# EAGLE design insect-bot (EAGLE 6.1)
Insect Bot schematic
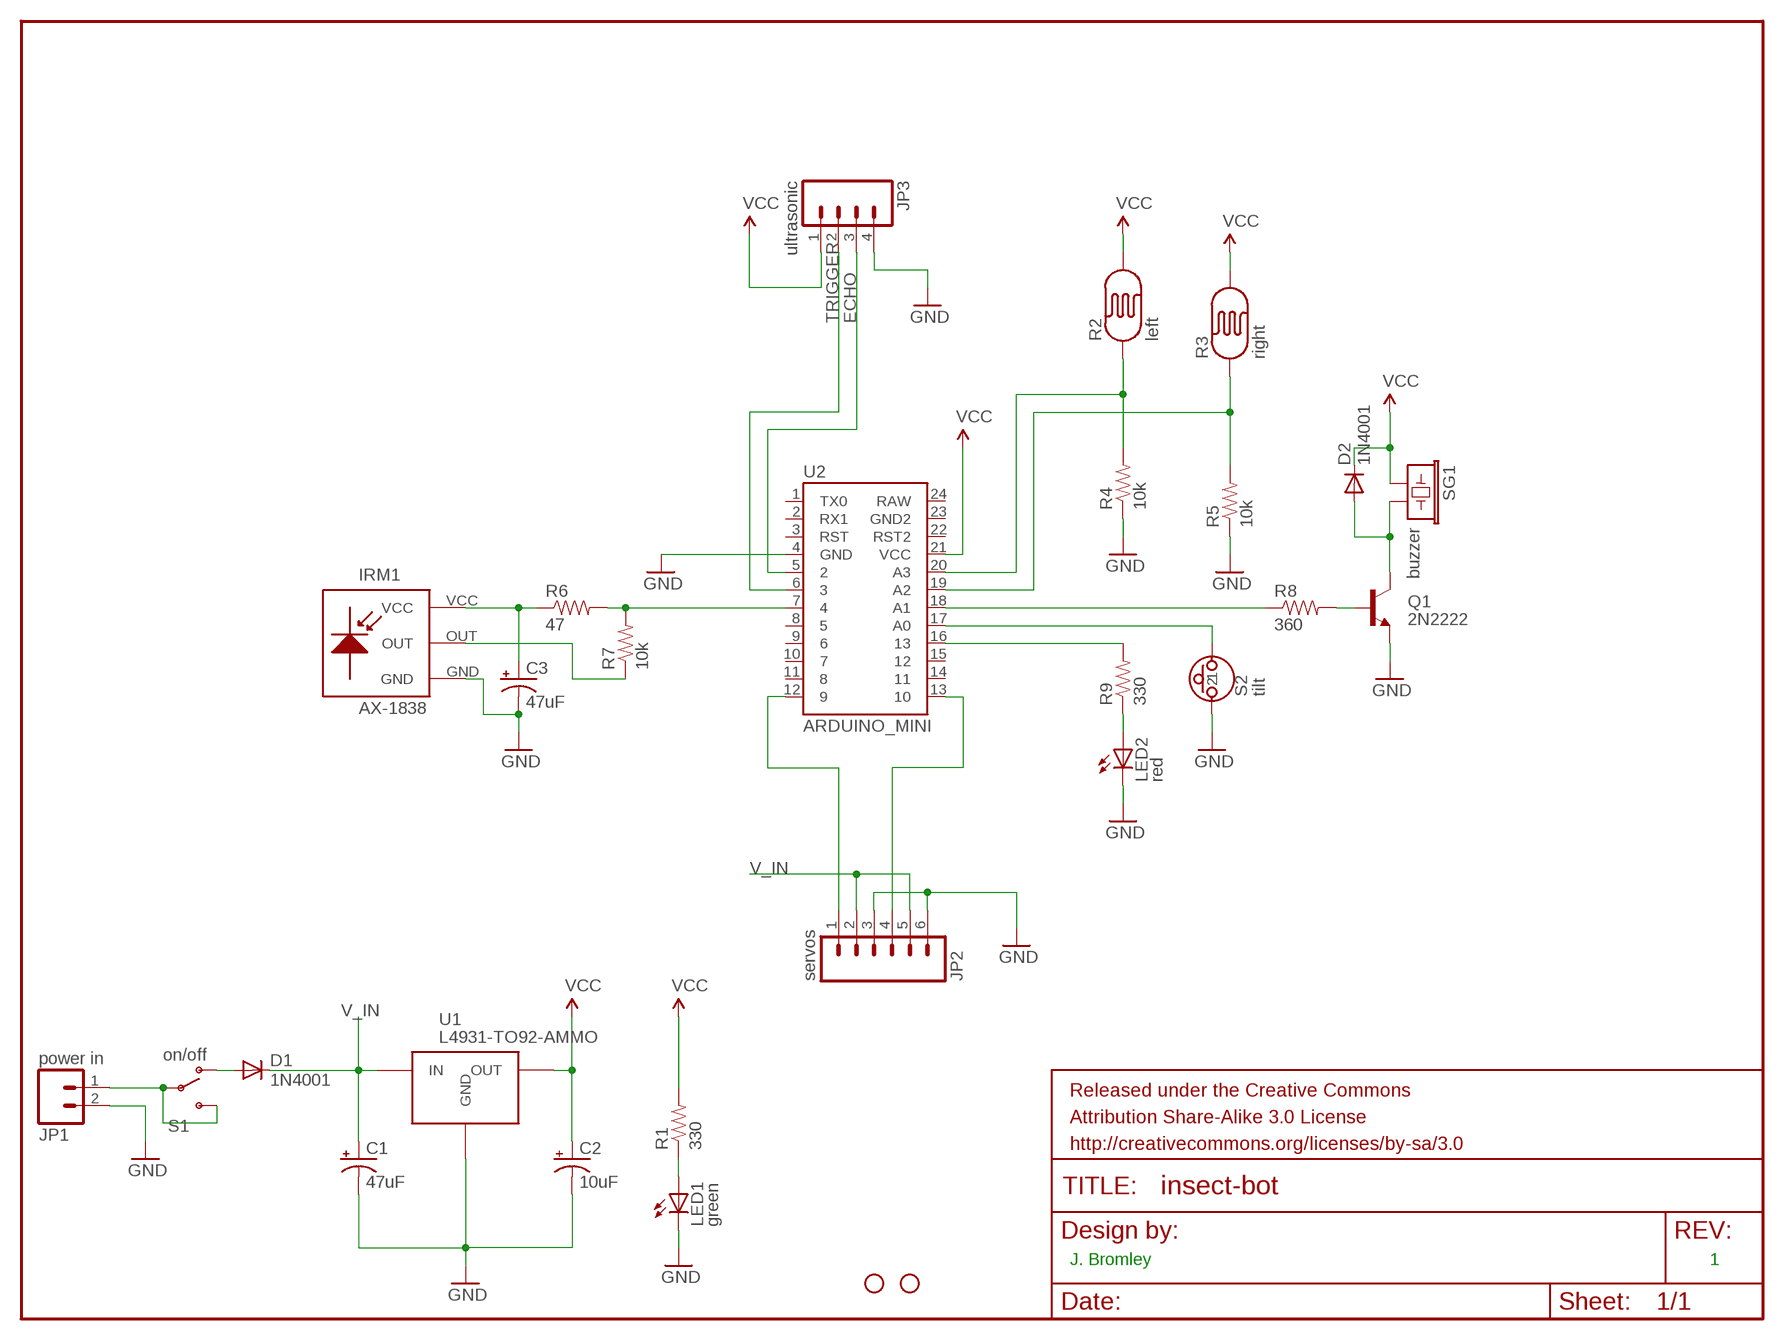
[diagram p0: schematic, sheet 1]

## Parts
C1  47uF  CAP_POLPTH2  [CPOL-RADIAL-10UF-25V]
C2  10uF  CAP_POLPTH2  [CPOL-RADIAL-10UF-25V]
C3  47uF  CAP_POLPTH1  [CPOL-RADIAL-100UF-25V]
D1  1N4001  DIODEPTH  [DIODE-1N4001]
D2  1N4001  DIODEPTH  [DIODE-1N4001]
IRM1  AX-1838  [AX-1838]
JP1  power in  M02PTH  [1X02]
JP2  servos  M06SIP  [1X06]
JP3  ultrasonic  M04PTH  [1X04]
JP4  STAND-OFF  [STAND-OFF]
JP5  STAND-OFF  [STAND-OFF]
LED1  green  LED3MM  [LED3MM]
LED2  red  LED3MM  [LED3MM]
Q1  2N2222  TRANSISTOR_NPNTO-92-AMMO  [TO-92-AMMO]
R1  330  RESISTORAXIAL-0.3  [AXIAL-0.3]
R2  left  PHOTOCELLPTH  [PHOTOCELL]
R3  right  PHOTOCELLPTH  [PHOTOCELL]
R4  10k  RESISTORAXIAL-0.3  [AXIAL-0.3]
R5  10k  RESISTORAXIAL-0.3  [AXIAL-0.3]
R6  47  RESISTORAXIAL-0.3  [AXIAL-0.3]
R7  10k  RESISTORAXIAL-0.3  [AXIAL-0.3]
R8  360  RESISTORAXIAL-0.3  [AXIAL-0.3]
R9  330  RESISTORAXIAL-0.3  [AXIAL-0.3]
S1  on/off  SWITCH-SPDTPTH  [SWITCH-SPDT]
S2  tilt  TILTSWITCH  [RADIAL-100]
SG1  buzzer  BUZZERPTH  [BUZZER-12MM]
U1  L4931-TO92-AMMO  [TO-92-AMMO]
U2  ARDUINO_MINI  [ARDUINO_MINI]

## Nets
ECHO: JP3.3 U2.5
GND [power]: C1.2(-) C2.2(-) C3.2(-) IRM1.GND JP1.2 JP2.3 JP2.6 JP3.4 LED1.K(C) LED2.K(C) Q1.1(E) R4.P$1 R5.P$1 S2.1 U1.2(GND) U2.4(GND)
N$1 [power]: JP1.1 S1.2(P) S1.3(S)
N$2 [power]: D1.A S1.1(O)
N$3: LED1.A R1.P$1
N$4: JP2.1 U2.12
N$5: JP2.4 U2.13
N$6: R8.P$1 U2.18(A1)
N$7: R3.1 R5.P$2 U2.19(A2)
N$8: R2.1 R4.P$2 U2.20(A3)
N$9: R6.P$2 R7.P$2 U2.7
N$10: Q1.2(B) R8.P$2
N$11: D2.A Q1.3(C) SG1.-
N$12: S2.2 U2.17(A0)
N$13: R9.P$2 U2.16
N$14: LED2.A R9.P$1
REMOTE: IRM1.OUT R7.P$1
TRIGGER: JP3.2 U2.6
V_IN [power]: C1.1(+) D1.C JP2.2 JP2.5 U1.1(IN)
VCC [power]: C2.1(+) C3.1(+) D2.C IRM1.VCC JP3.1 R1.P$2 R2.2 R3.2 R6.P$1 SG1.+ U1.3(OUT) U2.21(VCC)
Unconnected: U2.1(TX0) U2.2(RX1) U2.3(RST) U2.8 U2.9 U2.10 U2.11 U2.14 U2.15 U2.22(RST2) U2.23(GND2) U2.24(RAW)

## Notes on the sheet
- J. Bromley | 1

## Library data of the parts
C1-C3 = SparkFun-Passives:CAP_POL: Capacitor Polarized These are standard SMD and PTH capacitors. Normally 10uF, 47uF, and 100uF in electrolytic and tantalum varieties. Always verify the external diameter of the through hole cap, it varies with capacity, voltage, and manufacturer. The EIA devices should be standard.
D1 D2 = SparkFun-DiscreteSemi:DIODE: Diode These are standard reverse protection diodes and small signal diodes. SMA package can handle up to about 1A. SOD-323 can handle about 200mA. What the SOD-323 package when ordering, there are some mfgs out there that are 5-pin packages.
IRM1 = jb-eagle:AX-1838: AX-1838HS Infrared Receiver The AX-1838HS is a miniaturized infrared receiver for remote control and other applications requiring improved ambient light rejection.
JP1 = SparkFun-Connectors:M02: Header 2 Standard 2-pin 0.1" header. Use with straight break away headers (SKU : PRT-00116), right angle break away headers (PRT-00553), swiss pins (PRT-00743), machine pins (PRT-00117), and female headers (PRT-00115). Molex polarized connector foot print use with SKU : PRT-08233 with associated crimp pins and housings.
JP2 = SparkFun-Connectors:M06: Header 6 Standard 6-pin 0.1" header. Use with straight break away headers (SKU : PRT-00116), right angle break away headers (PRT-00553), swiss pins (PRT-00743), machine pins (PRT-00117), and female headers (PRT-00115). Molex polarized connector foot print use with SKU : PRT-08094 with associated crimp pins and housings. NOTES ON THE VARIANTS LOCK and LOCK_LONGPADS... This footprint was designed to help hold the alignment of a through-hole component (i.e. 6-pin header) while soldering it into place. You may notice that each hole has been shifted either up or down by 0.005 of an inch from it's more standard position (which is a perfectly straight line). This slight alteration caused the pins (the squares in the middle) to touch the edges of the holes. Because they are alternating, it causes a "brace" to hold the component in place. 0.005 has proven to be the perfect amount of "off-center" position when using our standard breakaway headers. Although looks a little odd when you look at the bare footprint, once you have a header in there, the alteration is very hard to notice. Also, if you push a header all the way into place, it is covered up entirely on the bottom side. This idea of altering the position of holes to aid alignment will be further integrated into the Sparkfun Library for other footprints. It can help hold any component with 3 or more connection pins.
JP3 = SparkFun-Connectors:M04: Header 4 Standard 4-pin 0.1" header. Use with straight break away headers (SKU : PRT-00116), right angle break away headers (PRT-00553), swiss pins (PRT-00743), machine pins (PRT-00117), and female headers (PRT-00115). Molex polarized connector foot print use with SKU : PRT-08231 with associated crimp pins and housings. 1MM SMD Version SKU: PRT-10208
JP4 JP5 = SparkFun-Electromechanical:STAND-OFF: #4 Stand Off This is the mechanical footprint for a #4 phillips button head screw. Use the keepout ring to avoid running the screw head into surrounding components. SKU : PRT-00447
LED1 LED2 = SparkFun-LED:LED: LEDs Standard schematic elements and footprints for 5mm, 3mm, 1206, and 0603 sized LEDs. 5mm - Spark Fun Electronics SKU : COM-00529 (and others)
Q1 = SparkFun-DiscreteSemi:TRANSISTOR_NPN: Generic NPN BJT. MMBT2222 is the common NPN we use. Double check against datasheet- not all devices are the same!
R1 R4-R9 = SparkFun-Passives:RESISTOR: Resistor Basic schematic elements and footprints for 0603, 1206, and PTH resistors.
R2 R3 = SparkFun-Sensors:PHOTOCELL: CdS photoresistor. This is a low cost way to detect light levels. Resistance decreases with more incoming light. SparkFun SKU: SEN-09088
S1 = SparkFun-Electromechanical:SWITCH-SPDT: SPST Switch Simple slide switch. Spark Fun Electronics SKU : COM-00102
S2 = jb-eagle:TILTSWITCH: Rolling ball sensor, normally open
SG1 = SparkFun-Electromechanical:BUZZER: Buzzer 12mm Spark Fun Electronics SKU : Comp-Buzzer
U1 = jb-eagle:L4931-TO92-AMMO: Very low dropout regulator.
U2 = SparkFun-Boards:ARDUINO_MINI: Arduino Pro Mini footprint

## Net classes
0 default: width 0.61 mm, drill 0.203 mm, clearance 0.406 mm
1 power: width 0.813 mm, drill 0.203 mm, clearance 0.406 mm

## Board
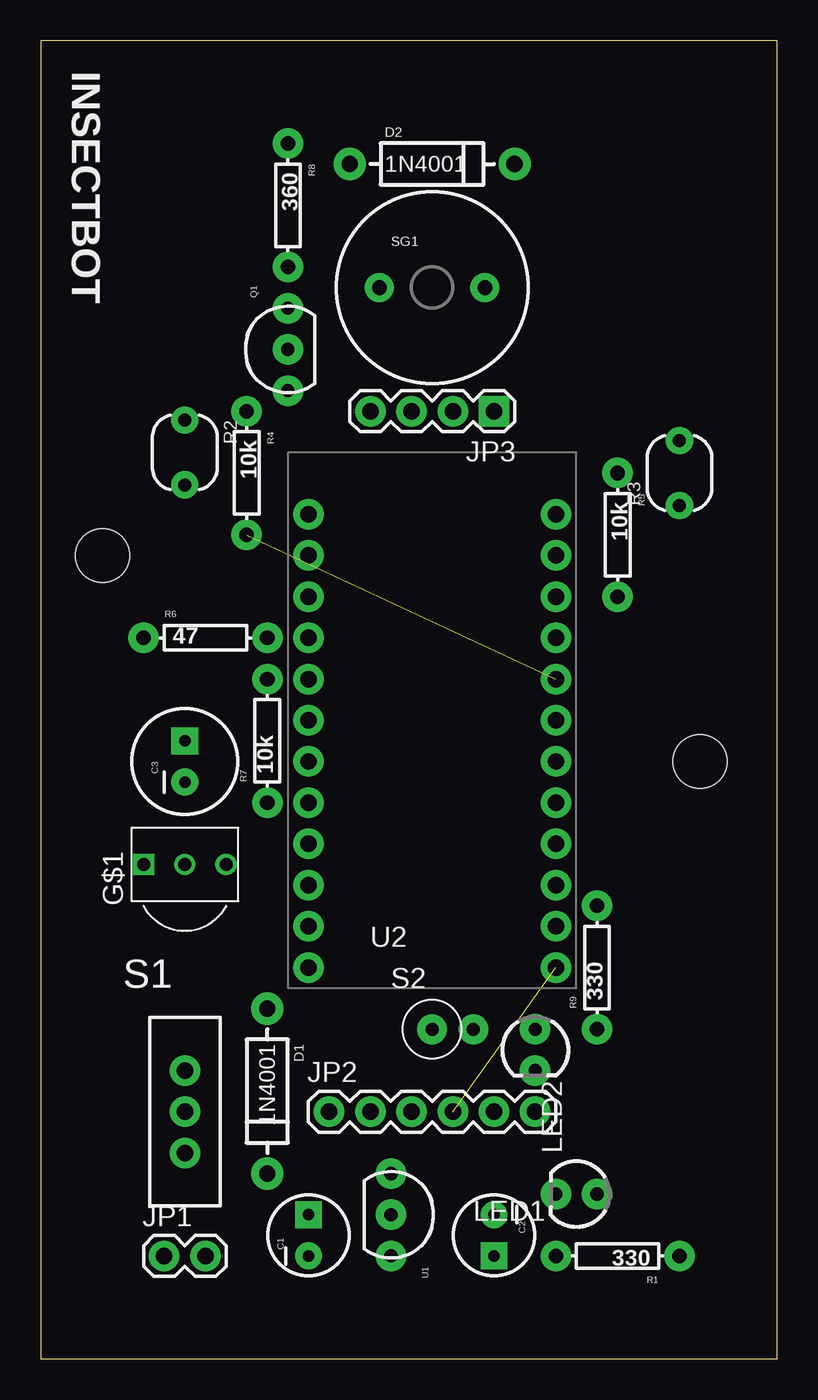
[diagram p1: board, top side]
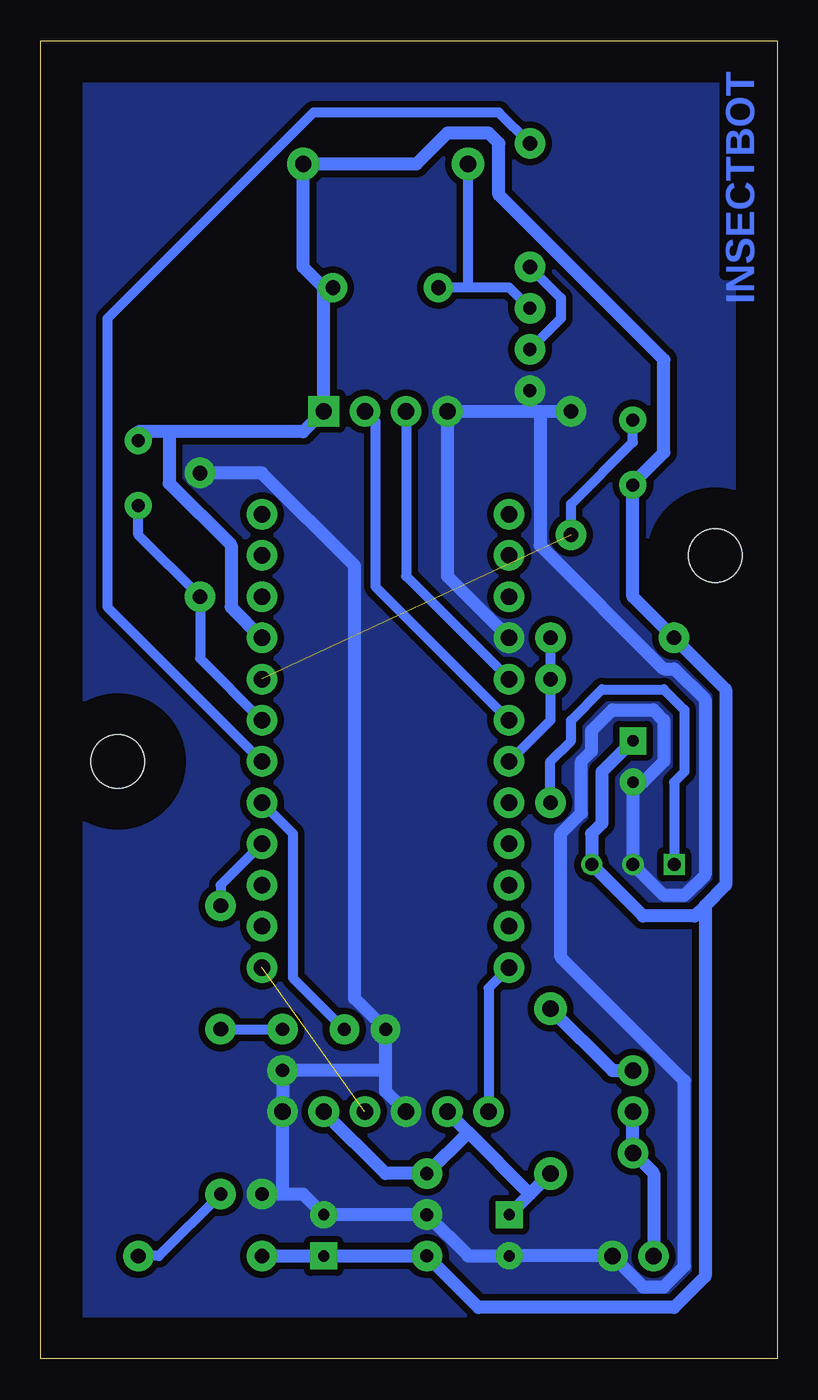
[diagram p2: board, bottom side, seen from below]

Size 45.39 x 81.27 mm. Coordinates in mm from the lower left corner, seen from the top.
Outline: 0,0 45.39,0 45.39,81.27 0,81.27 0,0
Copper layers (1*16): Top 0.035mm / dielectric 1.5mm / Bottom 0.035mm
Design rules: minimum track width 10mil, minimum drill 24mil, track to track 8mil, track to pad 8mil, pad to pad 8mil, via to via 8mil, smd to smd 8mil, copper to edge 100mil, drill to drill 8mil, minimum pad ring 10mil, minimum via ring 8mil, stop-mask expansion 4mil, vias tented up to drill 0mil, thermal gap 10mil

### Footprints (pad centres in the part's own frame; a part is rotated, then mirrored left to right if it is on the bottom)
CPOL-RADIAL-10UF-25V = drill 0.7 pad 1.651 square: 1 1.27,0 | drill 0.7 pad 1.651: 2 -1.27,0
CPOL-RADIAL-100UF-25V = drill 0.7 pad 1.651 square: 1 1.27,0 | drill 0.7 pad 1.651: 2 -1.27,0
DIODE-1N4001 = drill 1 pad 1.981: A -5.08,0; C 5.08,0
AX-1838 = drill 0.8: GND 0,0; VCC 0,-2.54 | drill 0.8 square: OUT 0,2.54
1X02 = drill 1.016 pad 1.88: 1 0,0; 2 2.54,0
1X06 = drill 1.016 pad 1.88: 1 0,0; 2 2.54,0; 3 5.08,0; 4 7.62,0; 5 10.16,0; 6 12.7,0
1X04 = drill 1.016 pad 1.88 square: 1 0,0 | drill 1.016 pad 1.88: 2 2.54,0; 3 5.08,0; 4 7.62,0
STAND-OFF = hole 3.302: 0,0
LED3MM = drill 0.813 pad 1.88: A -1.27,0; K 1.27,0
TO-92-AMMO = drill 0.813 pad 1.88: 1 -2.54,0; 2 0,0; 3 2.54,0
AXIAL-0.3 = drill 0.9 pad 1.88: P$1 -3.81,0; P$2 3.81,0
PHOTOCELL = drill 0.8 pad 1.676: 1 -2,0; 2 2,0
SWITCH-SPDT = drill 1.016 pad 1.88: 1 0,2.54; 2 0,0; 3 0,-2.54
RADIAL-100 = drill 0.8 pad 1.829: 1 0,0; 2 2.54,0
BUZZER-12MM = drill 0.9 pad 1.778: + 3.25,0; - -3.25,0
ARDUINO_MINI = drill 1.016 pad 1.88: 1 -7.62,12.7; 2 -7.62,10.16; 3 -7.62,7.62; 4 -7.62,5.08; 5 -7.62,2.54; 6 -7.62,0; 7 -7.62,-2.54; 8 -7.62,-5.08; 9 -7.62,-7.62; 10 -7.62,-10.16; 11 -7.62,-12.7; 12 -7.62,-15.24; 13 7.62,-15.24; 14 7.62,-12.7; 15 7.62,-10.16; 16 7.62,-7.62; 17 7.62,-5.08; 18 7.62,-2.54; 19 7.62,0; 20 7.62,2.54; 21 7.62,5.08; 22 7.62,7.62; 23 7.62,10.16; 24 7.62,12.7

### Placement (x,y rotation side)
C1  16.51,7.62 90 top
C2  27.94,7.62 270 top
C3  8.89,36.83 90 top
D1  13.97,16.51 270 top
D2  24.13,73.66 0 top
IRM1  8.89,30.48 90 top
JP1  7.62,6.35 0 top
JP2  17.78,15.24 0 top
JP3  27.94,58.42 180 top
JP4  40.64,36.83 0 top
JP5  3.81,49.53 0 top
LED1  33.02,10.16 180 top
LED2  30.48,19.05 270 top
Q1  15.24,62.23 90 top
R1  35.56,6.35 180 top
R2  8.89,55.88 270 top
R3  39.37,54.61 90 top
R4  12.7,54.61 270 top
R5  35.56,50.8 270 top
R6  10.16,44.45 0 top
R7  13.97,38.1 90 top
R8  15.24,71.12 270 top
R9  34.29,24.13 90 top
S1  8.89,15.24 0 top
S2  24.13,20.32 0 top
SG1  24.13,66.04 0 top
U1  21.59,8.89 270 top
U2  24.13,39.37 0 top

### Tracks (layer width: path | path; a pad name or v marks a point on that pad's centre or on a via)
ECHO
  Bottom 0.61: U2.5 22.86,48.26 JP3.3
GND
  Bottom 0.813: U2.4 20.32,48.26 JP3.4 15.24,58.42 | 15.24,58.42 14.61,58.42 | 14.61,58.42 R4.P$1 | 15.24,58.42 Q1.1 | 14.61,58.42 14.61,50.16 6.99,42.55 6.35,42.55 4.45,40.64 4.45,29.84 5.71,28.57 6.99,28.57 IRM1.GND C3.2 8.26,35.56 6.99,36.83 6.99,39.37 7.62,40.01 10.16,40.01 11.43,38.73 11.43,37.47 12.06,36.83 12.06,33.66 13.34,32.38 13.34,24.77 5.71,17.14 5.71,5.71 6.99,4.45 8.26,4.45 JP1.2 C1.2 19.05,6.35 U1.2 C2.2 29.21,10.16 30.48,10.16 | 30.48,10.16 LED1.K | 30.48,10.16 JP2.6 LED2.K 24.13,17.78 | 24.13,17.78 24.13,16.51 JP2.3 | 24.13,17.78 S2.1 26.04,22.23 26.04,48.9 31.75,54.61 R5.P$1
  pour Bottom (no thermals): 1.27,80.01 1.27,1.27 44.45,1.27 44.45,80.01
N$1
  Bottom 0.813: JP1.1 7.62,11.43 S1.3 S1.2
N$2
  Bottom 0.813: S1.1 10.16,17.78 D1.A
N$3
  Bottom 0.61: R1.P$1 38.1,6.35 LED1.A
N$4
  Bottom 0.61: JP2.1 17.78,22.86 U2.12
N$5  (1 unrouted)
N$6
  Bottom 0.61: U2.18 41.27,46.35 41.27,64.14 28.57,76.83 17.14,76.83 R8.P$1
N$7
  Bottom 0.61: R3.1 39.37,50.8 R5.P$2 35.56,43.18 U2.19
N$8  (1 unrouted)
  Bottom 0.61: R2.1 8.89,56.52 12.7,52.7 R4.P$2
N$9
  Bottom 0.61: R6.P$2 R7.P$2 13.97,39.37 U2.7
N$10
  Bottom 0.61: Q1.2 13.34,64.14 13.34,65.41 R8.P$2
N$11
  Bottom 0.61: 19.05,66.04 16.51,66.04 Q1.3 | 19.05,66.04 SG1.- | 19.05,66.04 D2.A
N$12
  Bottom 0.61: S2.2 29.84,23.5 29.84,32.38 U2.17
N$13
  Bottom 0.61: R9.P$2 34.29,29.21 U2.16
N$14
  Bottom 0.61: R9.P$1 LED2.A
REMOTE
  Bottom 0.61: IRM1.OUT 6.35,35.56 5.71,36.2 5.71,40.01 6.99,41.27 10.79,41.27 12.7,39.37 12.7,38.1 13.97,36.83 R7.P$1
TRIGGER
  Bottom 0.61: U2.6 24.77,47.62 24.77,57.78 JP3.2
V_IN
  Bottom 0.813: D1.C 15.24,10.16 | 15.24,10.16 C1.1 | 15.24,10.16 19.05,13.97 | 19.05,13.97 JP2.2 | 19.05,13.97 U1.1 24.13,11.43 JP2.5
VCC
  Bottom 0.813: 37.47,57.15 29.21,57.15 JP3.1 27.94,66.04 | 37.47,57.15 39.37,57.15 R3.2 | U2.21 33.66,46.35 33.66,50.16 37.47,53.98 37.47,57.15 | 27.94,66.04 29.21,67.31 D2.C 22.23,73.66 20.32,75.56 17.78,75.56 17.14,74.93 17.14,71.75 6.99,61.59 6.99,55.88 8.89,53.98 R2.2 8.89,46.99 R6.P$1 3.17,41.27 3.17,29.21 4.45,27.94 | 27.94,66.04 SG1.+ | R1.P$2 C2.1 U1.3 18.41,3.17 6.35,3.17 4.45,5.08 4.45,27.94 | C3.1 10.79,36.2 10.79,33.02 11.43,32.38 IRM1.VCC 8.26,27.3 5.08,27.3 4.45,27.94

### Text on the board
Bottom: INSECTBOT
tPlace: INSECTBOT